# EAGLE schematic 2.5inchv4 (EAGLE 7.6.0)
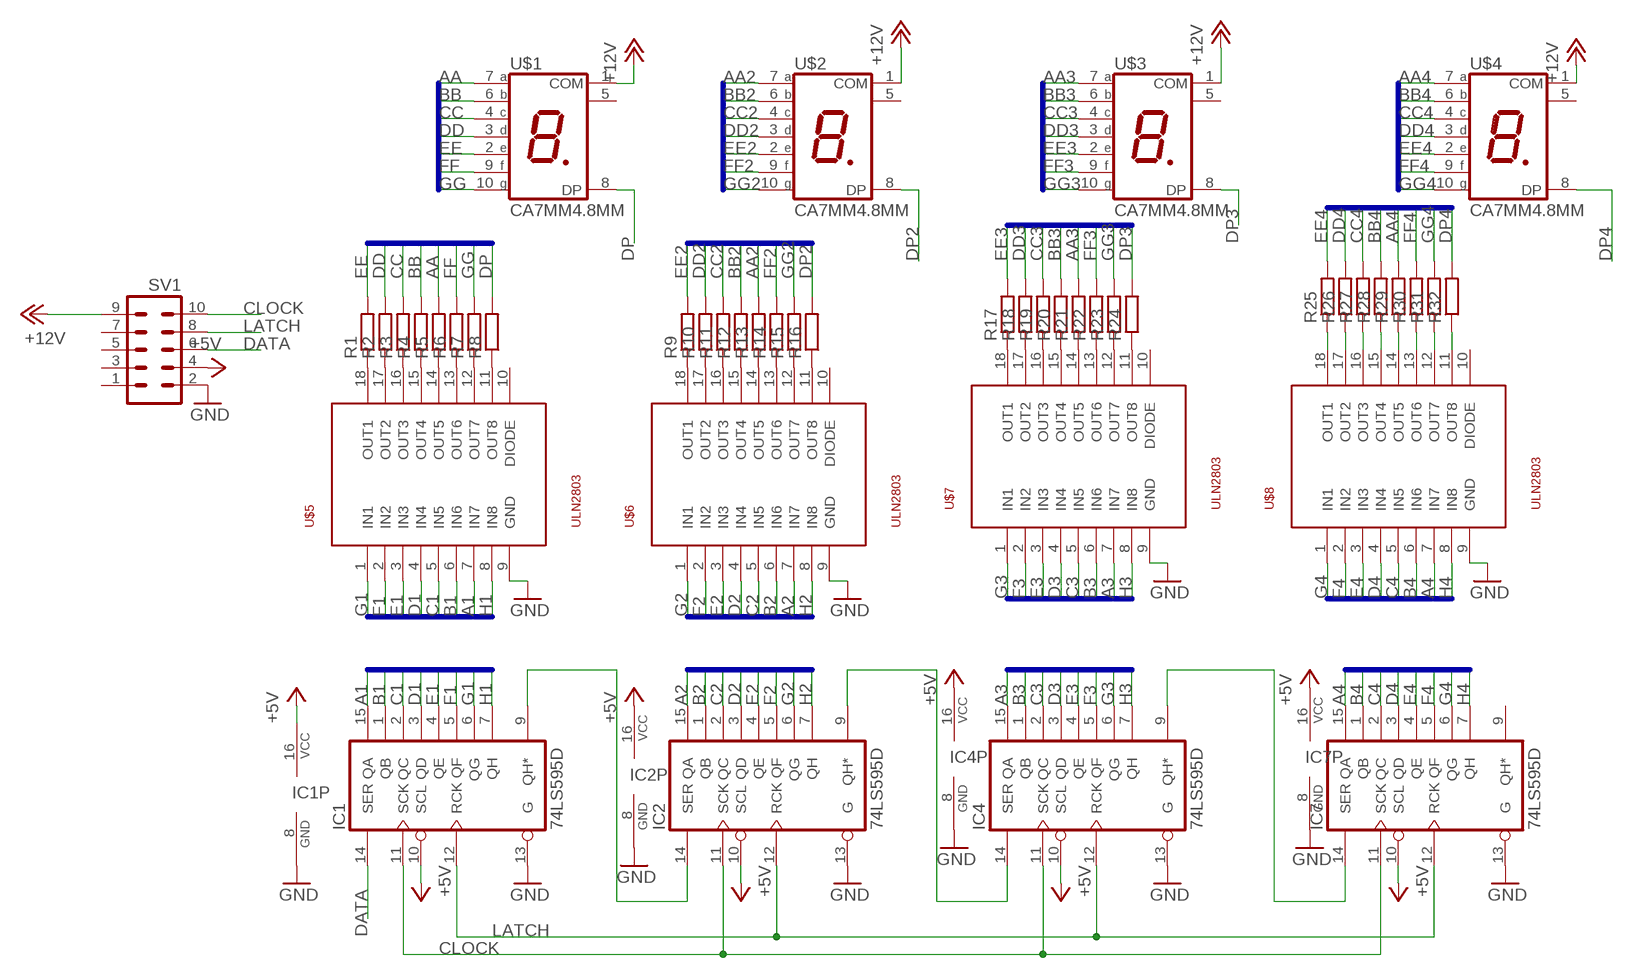
[diagram p0: schematic, sheet 1]

## Parts
IC1  74LS595D  [SO16]
IC2  74LS595D  [SO16]
IC4  74LS595D  [SO16]
IC7  74LS595D  [SO16]
R1  R-EU_0207/12  [0207/12]
R2  R-EU_0207/12  [0207/12]
R3  R-EU_0207/12  [0207/12]
R4  R-EU_0207/12  [0207/12]
R5  R-EU_0207/12  [0207/12]
R6  R-EU_0207/12  [0207/12]
R7  R-EU_0207/12  [0207/12]
R8  R-EU_0207/12  [0207/12]
R9  R-EU_0207/12  [0207/12]
R10  R-EU_0207/12  [0207/12]
R11  R-EU_0207/12  [0207/12]
R12  R-EU_0207/12  [0207/12]
R13  R-EU_0207/12  [0207/12]
R14  R-EU_0207/12  [0207/12]
R15  R-EU_0207/12  [0207/12]
R16  R-EU_0207/12  [0207/12]
R17  R-EU_0207/12  [0207/12]
R18  R-EU_0207/12  [0207/12]
R19  R-EU_0207/12  [0207/12]
R20  R-EU_0207/12  [0207/12]
R21  R-EU_0207/12  [0207/12]
R22  R-EU_0207/12  [0207/12]
R23  R-EU_0207/12  [0207/12]
R24  R-EU_0207/12  [0207/12]
R25  R-EU_0207/12  [0207/12]
R26  R-EU_0207/12  [0207/12]
R27  R-EU_0207/12  [0207/12]
R28  R-EU_0207/12  [0207/12]
R29  R-EU_0207/12  [0207/12]
R30  R-EU_0207/12  [0207/12]
R31  R-EU_0207/12  [0207/12]
R32  R-EU_0207/12  [0207/12]
SV1  ML10  [ML10]
U$1  CA7MM4.8MM  [CA7MM*4.8MM]
U$2  CA7MM4.8MM  [CA7MM*4.8MM]
U$3  CA7MM4.8MM  [CA7MM*4.8MM]
U$4  CA7MM4.8MM  [CA7MM*4.8MM]
U$5  ULN2803  [SO18L]
U$6  ULN2803  [SO18L]
U$7  ULN2803  [SO18L]
U$8  ULN2803  [SO18L]

## Nets
+5V: IC1.10(SCL) IC1.16(VCC) IC2.10(SCL) IC2.16(VCC) IC4.10(SCL) IC4.16(VCC) IC7.10(SCL) IC7.16(VCC) SV1.4
+12V: SV1.9 U$1.1(COM) U$2.1(COM) U$3.1(COM) U$4.1(COM)
A1: IC1.15(QA) U$5.7(IN7)
A2: IC2.15(QA) U$6.7(IN7)
A3: IC4.15(QA) U$7.7(IN7)
A4: IC7.15(QA) U$8.7(IN7)
AA: R5.2 U$1.7(A)
AA2: R13.2 U$2.7(A)
AA3: R21.2 U$3.7(A)
AA4: R29.2 U$4.7(A)
B1: IC1.1(QB) U$5.6(IN6)
B2: IC2.1(QB) U$6.6(IN6)
B3: IC4.1(QB) U$7.6(IN6)
B4: IC7.1(QB) U$8.6(IN6)
BB: R4.2 U$1.6(B)
BB2: R12.2 U$2.6(B)
BB3: R20.2 U$3.6(B)
BB4: R28.2 U$4.6(B)
C1: IC1.2(QC) U$5.5(IN5)
C2: IC2.2(QC) U$6.5(IN5)
C3: IC4.2(QC) U$7.5(IN5)
C4: IC7.2(QC) U$8.5(IN5)
CC: R3.2 U$1.4(C)
CC2: R11.2 U$2.4(C)
CC3: R19.2 U$3.4(C)
CC4: R27.2 U$4.4(C)
CLOCK: IC1.11(SCK) IC2.11(SCK) IC4.11(SCK) IC7.11(SCK) SV1.10
D1: IC1.3(QD) U$5.4(IN4)
D2: IC2.3(QD) U$6.4(IN4)
D3: IC4.3(QD) U$7.4(IN4)
D4: IC7.3(QD) U$8.4(IN4)
DATA: IC1.14(SER) SV1.6
DD: R2.2 U$1.3(D)
DD2: R10.2 U$2.3(D)
DD3: R18.2 U$3.3(D)
DD4: R26.2 U$4.3(D)
DP: R8.2 U$1.8(DP)
DP2: R16.2 U$2.8(DP)
DP3: R24.2 U$3.8(DP)
DP4: R32.2 U$4.8(DP)
E1: IC1.4(QE) U$5.3(IN3)
E2: IC2.4(QE) U$6.3(IN3)
E3: IC4.4(QE) U$7.3(IN3)
E4: IC7.4(QE) U$8.3(IN3)
EE: R1.2 U$1.2(E)
EE2: R9.2 U$2.2(E)
EE3: R17.2 U$3.2(E)
EE4: R25.2 U$4.2(E)
F1: IC1.5(QF) U$5.2(IN2)
F2: IC2.5(QF) U$6.2(IN2)
F3: IC4.5(QF) U$7.2(IN2)
F4: IC7.5(QF) U$8.2(IN2)
FF: R6.2 U$1.9(F)
FF2: R14.2 U$2.9(F)
FF3: R22.2 U$3.9(F)
FF4: R30.2 U$4.9(F)
G1: IC1.6(QG) U$5.1(IN1)
G2: IC2.6(QG) U$6.1(IN1)
G3: IC4.6(QG) U$7.1(IN1)
G4: IC7.6(QG) U$8.1(IN1)
GG: R7.2 U$1.10(G)
GG2: R15.2 U$2.10(G)
GG3: R23.2 U$3.10(G)
GG4: R31.2 U$4.10(G)
GND: IC1.8(GND) IC1.13(G) IC2.8(GND) IC2.13(G) IC4.8(GND) IC4.13(G) IC7.8(GND) IC7.13(G) SV1.2 U$5.9(GND) U$6.9(GND) U$7.9(GND) U$8.9(GND)
H1: IC1.7(QH) U$5.8(IN8)
H2: IC2.7(QH) U$6.8(IN8)
H3: IC4.7(QH) U$7.8(IN8)
H4: IC7.7(QH) U$8.8(IN8)
LATCH: IC1.12(RCK) IC2.12(RCK) IC4.12(RCK) IC7.12(RCK) SV1.8
N$1: IC1.9(QH*) IC2.14(SER)
N$2: IC2.9(QH*) IC4.14(SER)
N$3: IC4.9(QH*) IC7.14(SER)
N$6: R1.1 U$5.18(OUT1)
N$7: R2.1 U$5.17(OUT2)
N$8: R3.1 U$5.16(OUT3)
N$9: R4.1 U$5.15(OUT4)
N$10: R5.1 U$5.14(OUT5)
N$11: R6.1 U$5.13(OUT6)
N$12: R7.1 U$5.12(OUT7)
N$13: R8.1 U$5.11(OUT8)
N$14: R9.1 U$6.18(OUT1)
N$15: R10.1 U$6.17(OUT2)
N$16: R11.1 U$6.16(OUT3)
N$17: R12.1 U$6.15(OUT4)
N$18: R13.1 U$6.14(OUT5)
N$19: R14.1 U$6.13(OUT6)
N$20: R15.1 U$6.12(OUT7)
N$21: R16.1 U$6.11(OUT8)
N$22: R17.1 U$7.18(OUT1)
N$23: R18.1 U$7.17(OUT2)
N$24: R19.1 U$7.16(OUT3)
N$25: R20.1 U$7.15(OUT4)
N$26: R21.1 U$7.14(OUT5)
N$27: R22.1 U$7.13(OUT6)
N$28: R23.1 U$7.12(OUT7)
N$29: R24.1 U$7.11(OUT8)
N$30: R25.1 U$8.18(OUT1)
N$31: R26.1 U$8.17(OUT2)
N$32: R27.1 U$8.16(OUT3)
N$33: R28.1 U$8.15(OUT4)
N$34: R29.1 U$8.14(OUT5)
N$35: R30.1 U$8.13(OUT6)
N$36: R31.1 U$8.12(OUT7)
N$37: R32.1 U$8.11(OUT8)
Unconnected: IC7.9(QH*) SV1.1 SV1.3 SV1.5 SV1.7 U$1.5(COM) U$2.5(COM) U$3.5(COM) U$4.5(COM) U$5.10(DIODE) U$6.10(DIODE) U$7.10(DIODE) U$8.10(DIODE)

## Buses
B$2
B$1
B$3
B$4

## Library data of the parts
IC1 IC2 IC4 IC7 = 74xx-us:74*595: 8-bit SHIFT REGISTER, output latch
R1-R32 = rcl:R-EU_: RESISTOR, European symbol
SV1 = con-harting-ml:ML10: HARTING; OC_FARNELL: unknown; OC_NEWARK: unknown
U$1-U$4 = display-kingbright-2:CA7MM*4.8MM: Seven Segment Common Anode 4.8Inch
U$5-U$8 = uln2803:ULN2803